# Altium schematic sheet OverviewRev2.SchDoc
size 594 x 420 mm; SheetNumber: 10; SheetTotal: 14
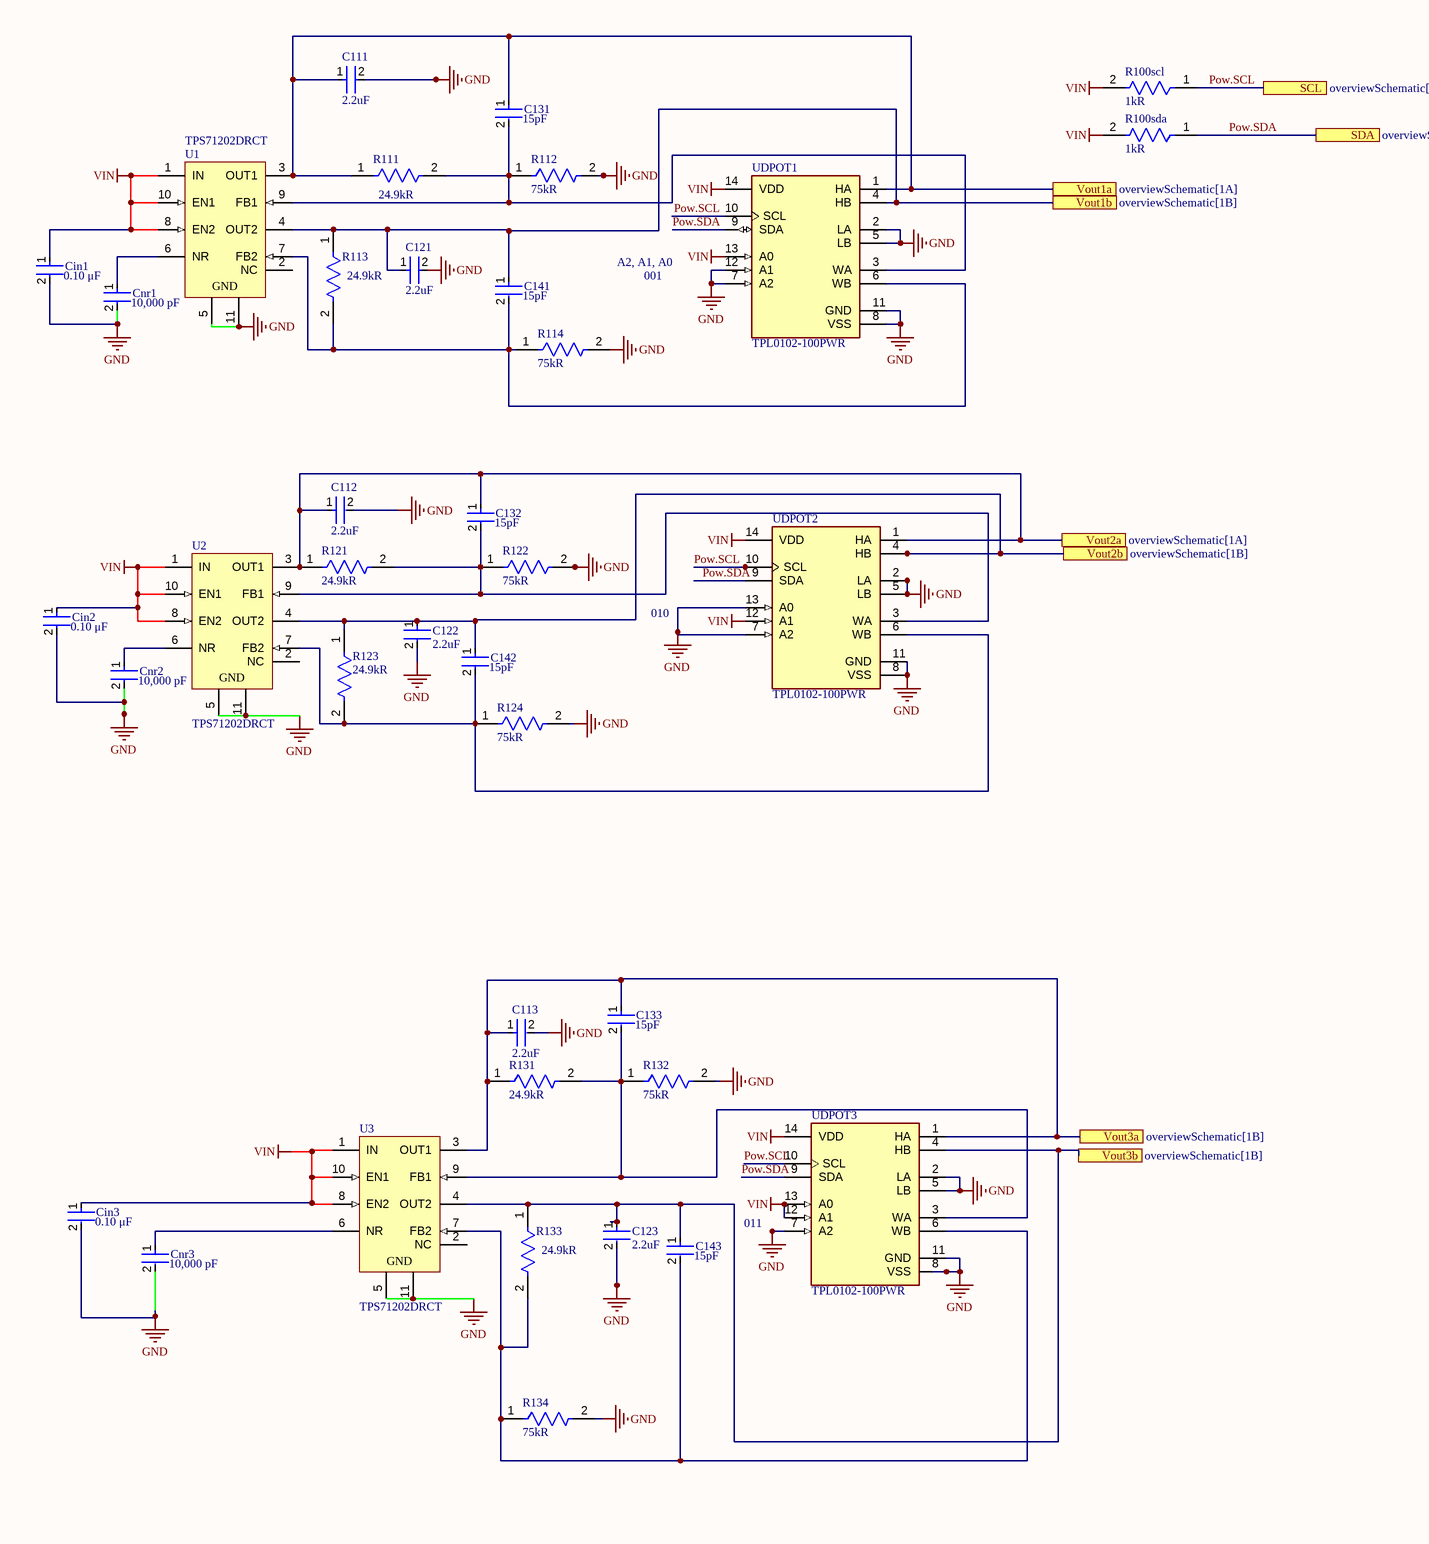
[diagram p0: OverviewRev2.SchDoc, left]
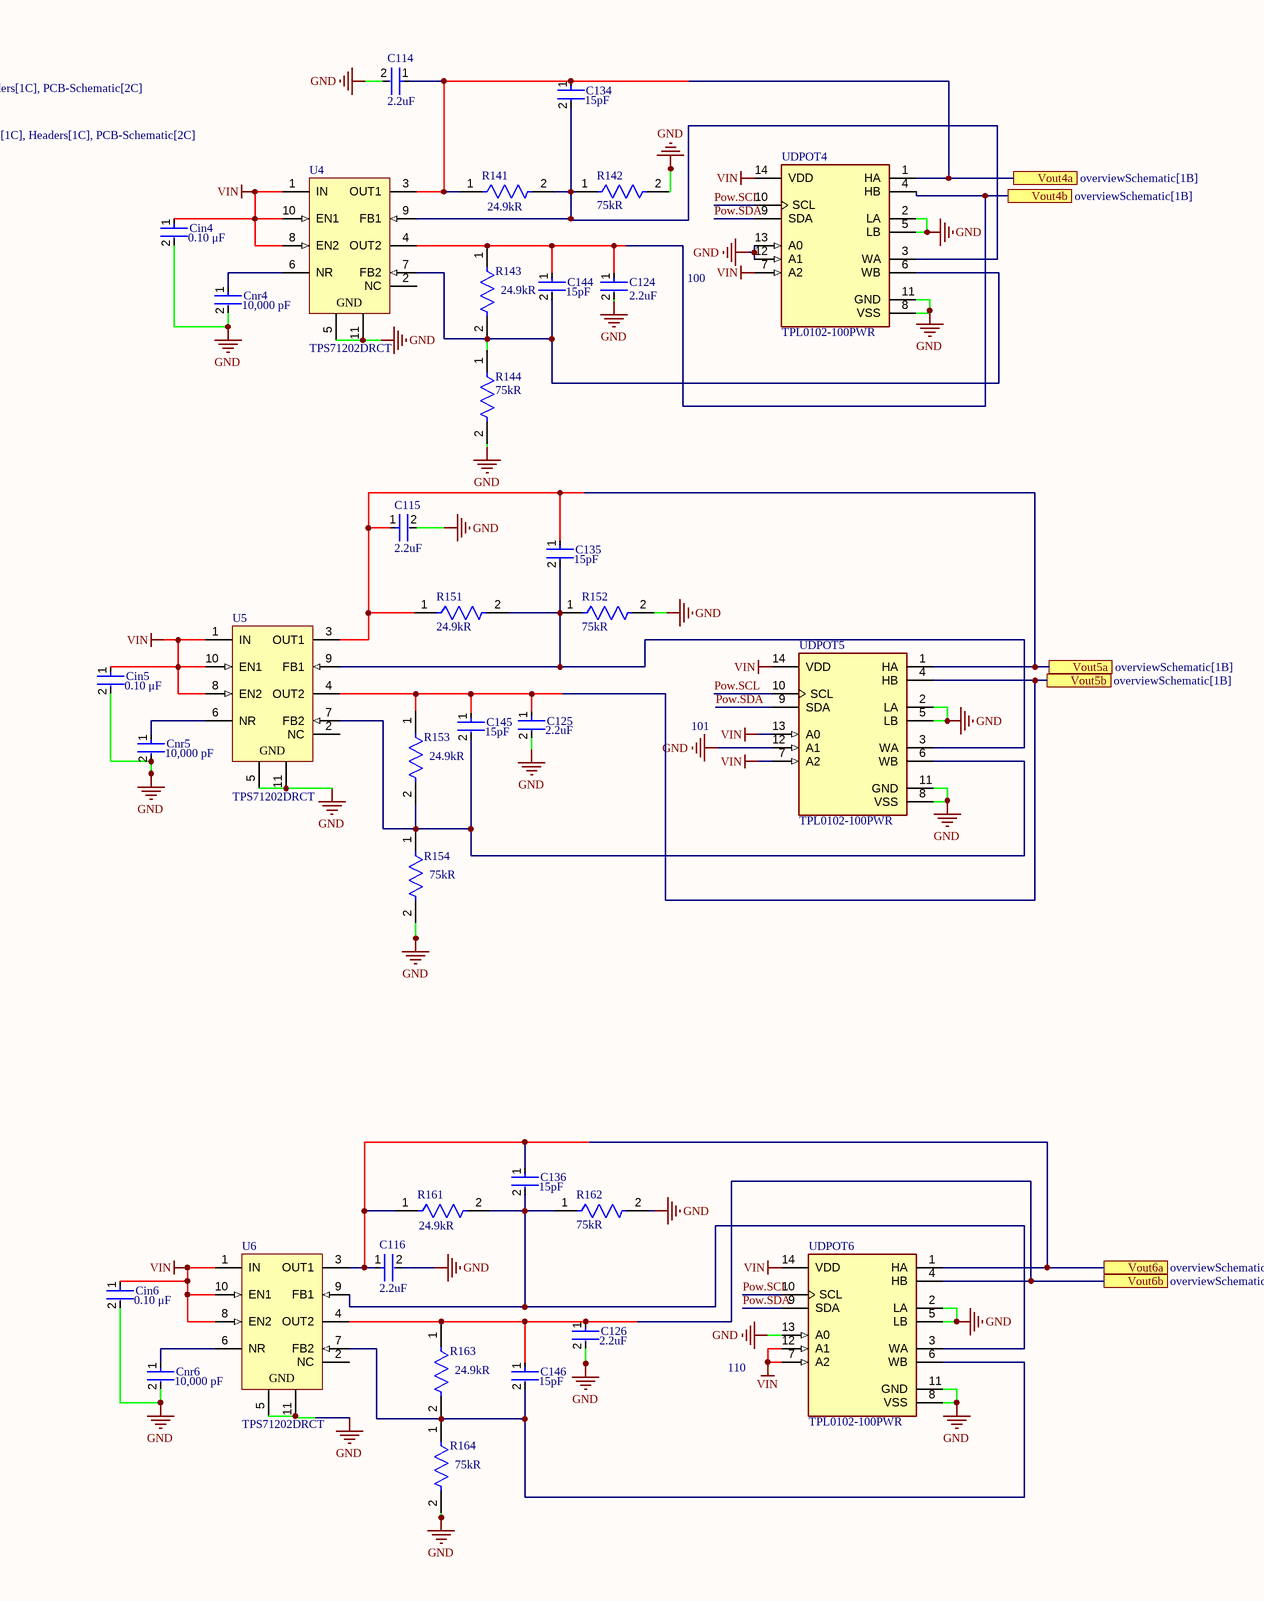
[diagram p1: OverviewRev2.SchDoc, right]

## Parts
C111  Capacitance: 2.2uF  [FP-GRM188-0_1-e0_2_0_5-MFG]  (hidden comment: GRM188R71A225KE15D)
C112  Capacitance: 2.2uF  [FP-GRM188-0_1-e0_2_0_5-MFG]  (hidden comment: GRM188R71A225KE15D)
C113  Capacitance: 2.2uF  [FP-GRM188-0_1-e0_2_0_5-MFG]  (hidden comment: GRM188R71A225KE15D)
C114  Capacitance: 2.2uF  [FP-GRM188-0_1-e0_2_0_5-MFG]  (hidden comment: GRM188R71A225KE15D)
C115  Capacitance: 2.2uF  [FP-GRM188-0_1-e0_2_0_5-MFG]  (hidden comment: GRM188R71A225KE15D)
C116  Capacitance: 2.2uF  [FP-GRM188-0_1-e0_2_0_5-MFG]  (hidden comment: GRM188R71A225KE15D)
C121  Capacitance: 2.2uF  [FP-GRM188-0_1-e0_2_0_5-MFG]  (hidden comment: GRM188R71A225KE15D)
C122  Capacitance: 2.2uF  [FP-GRM188-0_1-e0_2_0_5-MFG]  (hidden comment: GRM188R71A225KE15D)
C123  Capacitance: 2.2uF  [FP-GRM188-0_1-e0_2_0_5-MFG]  (hidden comment: GRM188R71A225KE15D)
C124  Capacitance: 2.2uF  [FP-GRM188-0_1-e0_2_0_5-MFG]  (hidden comment: GRM188R71A225KE15D)
C125  Capacitance: 2.2uF  [FP-GRM188-0_1-e0_2_0_5-MFG]  (hidden comment: GRM188R71A225KE15D)
C126  Capacitance: 2.2uF  [FP-GRM188-0_1-e0_2_0_5-MFG]  (hidden comment: GRM188R71A225KE15D)
C131  Capacitance: 15pF  [FP-CC0402-0_55-IPC_B]  (hidden comment: CC0402JRNPO9BN150)
C132  Capacitance: 15pF  [FP-CC0402-0_55-IPC_B]  (hidden comment: CC0402JRNPO9BN150)
C133  Capacitance: 15pF  [FP-CC0402-0_55-IPC_B]  (hidden comment: CC0402JRNPO9BN150)
C134  Capacitance: 15pF  [FP-CC0402-0_55-IPC_B]  (hidden comment: CC0402JRNPO9BN150)
C135  Capacitance: 15pF  [FP-CC0402-0_55-IPC_B]  (hidden comment: CC0402JRNPO9BN150)
C136  Capacitance: 15pF  [FP-CC0402-0_55-IPC_B]  (hidden comment: CC0402JRNPO9BN150)
C141  Capacitance: 15pF  [FP-CC0402-0_55-IPC_B]  (hidden comment: CC0402JRNPO9BN150)
C142  Capacitance: 15pF  [FP-CC0402-0_55-IPC_B]  (hidden comment: CC0402JRNPO9BN150)
C143  Capacitance: 15pF  [FP-CC0402-0_55-IPC_B]  (hidden comment: CC0402JRNPO9BN150)
C144  Capacitance: 15pF  [FP-CC0402-0_55-IPC_B]  (hidden comment: CC0402JRNPO9BN150)
C145  Capacitance: 15pF  [FP-CC0402-0_55-IPC_B]  (hidden comment: CC0402JRNPO9BN150)
C146  Capacitance: 15pF  [FP-CC0402-0_55-IPC_B]  (hidden comment: CC0402JRNPO9BN150)
Cin1  Capacitance: 0.10 μF  [FP-C0603C-CF-MFG]  (hidden comment: C0603C104M4RACTU)
Cin2  Capacitance: 0.10 μF  [FP-C0603C-CF-MFG]  (hidden comment: C0603C104M4RACTU)
Cin3  Capacitance: 0.10 μF  [FP-C0603C-CF-MFG]  (hidden comment: C0603C104M4RACTU)
Cin4  Capacitance: 0.10 μF  [FP-C0603C-CF-MFG]  (hidden comment: C0603C104M4RACTU)
Cin5  Capacitance: 0.10 μF  [FP-C0603C-CF-MFG]  (hidden comment: C0603C104M4RACTU)
Cin6  Capacitance: 0.10 μF  [FP-C0603C-CF-MFG]  (hidden comment: C0603C104M4RACTU)
Cnr1  value 10,000 pF  [FP-C0603C-CF-MFG]  (hidden comment: C0603C103M5RACTU)
Cnr2  value 10,000 pF  [FP-C0603C-CF-MFG]  (hidden comment: C0603C103M5RACTU)
Cnr3  value 10,000 pF  [FP-C0603C-CF-MFG]  (hidden comment: C0603C103M5RACTU)
Cnr4  value 10,000 pF  [FP-C0603C-CF-MFG]  (hidden comment: C0603C103M5RACTU)
Cnr5  value 10,000 pF  [FP-C0603C-CF-MFG]  (hidden comment: C0603C103M5RACTU)
Cnr6  value 10,000 pF  [FP-C0603C-CF-MFG]  (hidden comment: C0603C103M5RACTU)
R100scl  Resistance: 1kR  [FP-RC1608-IPC_A]  (hidden comment: RC1608J102CS)
R100sda  Resistance: 1kR  [FP-RC1608-IPC_A]  (hidden comment: RC1608J102CS)
R111  Resistance: 24.9kR  [FP-CRCW0603-e3-IPC_B]  (hidden comment: CRCW060324K9FKEA)
R112  Resistance: 75kR  [FP-RC1608-IPC_A]  (hidden comment: RC1608J753CS)
R113  Resistance: 24.9kR  [FP-CRCW0603-e3-IPC_B]  (hidden comment: CRCW060324K9FKEA)
R114  Resistance: 75kR  [FP-RC1608-IPC_A]  (hidden comment: RC1608J753CS)
R121  Resistance: 24.9kR  [FP-CRCW0603-e3-IPC_B]  (hidden comment: CRCW060324K9FKEA)
R122  Resistance: 75kR  [FP-RC1608-IPC_A]  (hidden comment: RC1608J753CS)
R123  Resistance: 24.9kR  [FP-CRCW0603-e3-IPC_B]  (hidden comment: CRCW060324K9FKEA)
R124  Resistance: 75kR  [FP-RC1608-IPC_A]  (hidden comment: RC1608J753CS)
R131  Resistance: 24.9kR  [FP-CRCW0603-e3-IPC_B]  (hidden comment: CRCW060324K9FKEA)
R132  Resistance: 75kR  [FP-RC1608-IPC_A]  (hidden comment: RC1608J753CS)
R133  Resistance: 24.9kR  [FP-CRCW0603-e3-IPC_B]  (hidden comment: CRCW060324K9FKEA)
R134  Resistance: 75kR  [FP-RC1608-IPC_A]  (hidden comment: RC1608J753CS)
R141  Resistance: 24.9kR  [FP-CRCW0603-e3-IPC_B]  (hidden comment: CRCW060324K9FKEA)
R142  Resistance: 75kR  [FP-RC1608-IPC_A]  (hidden comment: RC1608J753CS)
R143  Resistance: 24.9kR  [FP-CRCW0603-e3-IPC_B]  (hidden comment: CRCW060324K9FKEA)
R144  Resistance: 75kR  [FP-RC1608-IPC_A]  (hidden comment: RC1608J753CS)
R151  Resistance: 24.9kR  [FP-CRCW0603-e3-IPC_B]  (hidden comment: CRCW060324K9FKEA)
R152  Resistance: 75kR  [FP-RC1608-IPC_A]  (hidden comment: RC1608J753CS)
R153  Resistance: 24.9kR  [FP-CRCW0603-e3-IPC_B]  (hidden comment: CRCW060324K9FKEA)
R154  Resistance: 75kR  [FP-RC1608-IPC_A]  (hidden comment: RC1608J753CS)
R161  Resistance: 24.9kR  [FP-CRCW0603-e3-IPC_B]  (hidden comment: CRCW060324K9FKEA)
R162  Resistance: 75kR  [FP-RC1608-IPC_A]  (hidden comment: RC1608J753CS)
R163  Resistance: 24.9kR  [FP-CRCW0603-e3-IPC_B]  (hidden comment: CRCW060324K9FKEA)
R164  Resistance: 75kR  [FP-RC1608-IPC_A]  (hidden comment: RC1608J753CS)
U1  TPS71202DRCT  [DRC0010L_V]
U2  TPS71202DRCT  [DRC0010L_V]
U3  TPS71202DRCT  [DRC0010L_V]
U4  TPS71202DRCT  [DRC0010L_V]
U5  TPS71202DRCT  [DRC0010L_V]
U6  TPS71202DRCT  [DRC0010L_V]
UDPOT1  TPL0102-100PWR  [FP-PW0014A-IPC_C]
UDPOT2  TPL0102-100PWR  [FP-PW0014A-IPC_C]
UDPOT3  TPL0102-100PWR  [FP-PW0014A-IPC_C]
UDPOT4  TPL0102-100PWR  [FP-PW0014A-IPC_C]
UDPOT5  TPL0102-100PWR  [FP-PW0014A-IPC_C]
UDPOT6  TPL0102-100PWR  [FP-PW0014A-IPC_C]

## Ports
SCL (see overviewSchematic[1C], Headers[1C], PCB-Schematic[2C]), SDA (see overviewSchematic[1C], Headers[1C], PCB-Schematic[2C]), Vout1a (see overviewSchematic[1A]), Vout1b (see overviewSchematic[1B]), Vout2a (see overviewSchematic[1A]), Vout2b (see overviewSchematic[1B]), Vout3a (see overviewSchematic[1B]), Vout3b (see overviewSchematic[1B]), Vout4a (see overviewSchematic[1B]), Vout4b (see overviewSchematic[1B]), Vout5a (see overviewSchematic[1B]), Vout5b (see overviewSchematic[1B]), Vout6a (see overviewSchematic[1B]), Vout6b (see overviewSchematic[1B])

## Nets
GND: C111.2 C112.2 C113.2 C114.2 C115.2 C116.2 C121.2 C122.2 C123.2 C124.2 C125.2 C126.2 Cin1.2 Cin2.2 Cin3.2 Cin4.2 Cin5.2 Cin6.2 Cnr1.2 Cnr2.2 Cnr3.2 Cnr4.2 Cnr5.2 Cnr6.2 R112.2 R114.2 R122.2 R124.2 R132.2 R134.2 R142.2 R144.2 R152.2 R154.2 R162.2 R164.2 U1.5(GND) U1.11(GND) U2.5(GND) U2.11(GND) U3.5(GND) U3.11(GND) U4.5(GND) U4.11(GND) U5.5(GND) U5.11(GND) U6.5(GND) U6.11(GND) UDPOT1.2(LA) UDPOT1.5(LB) UDPOT1.7(A2) UDPOT1.8(VSS) UDPOT1.11(GND) UDPOT1.12(A1) UDPOT2.2(LA) UDPOT2.5(LB) UDPOT2.7(A2) UDPOT2.8(VSS) UDPOT2.11(GND) UDPOT2.13(A0) UDPOT3.2(LA) UDPOT3.5(LB) UDPOT3.7(A2) UDPOT3.8(VSS) UDPOT3.11(GND) UDPOT4.2(LA) UDPOT4.5(LB) UDPOT4.8(VSS) UDPOT4.11(GND) UDPOT4.12(A1) UDPOT4.13(A0) UDPOT5.2(LA) UDPOT5.5(LB) UDPOT5.8(VSS) UDPOT5.11(GND) UDPOT5.12(A1) UDPOT6.2(LA) UDPOT6.5(LB) UDPOT6.8(VSS) UDPOT6.11(GND) UDPOT6.13(A0)
VIN: Cin1.1 Cin2.1 Cin3.1 Cin4.1 Cin5.1 Cin6.1 R100scl.2 R100sda.2 U1.1(IN) U1.8(EN2) U1.10(EN1) U2.1(IN) U2.8(EN2) U2.10(EN1) U3.1(IN) U3.8(EN2) U3.10(EN1) U4.1(IN) U4.8(EN2) U4.10(EN1) U5.1(IN) U5.8(EN2) U5.10(EN1) U6.1(IN) U6.8(EN2) U6.10(EN1) UDPOT1.13(A0) UDPOT1.14(VDD) UDPOT2.12(A1) UDPOT2.14(VDD) UDPOT3.12(A1) UDPOT3.13(A0) UDPOT3.14(VDD) UDPOT4.7(A2) UDPOT4.14(VDD) UDPOT5.7(A2) UDPOT5.13(A0) UDPOT5.14(VDD) UDPOT6.7(A2) UDPOT6.12(A1) UDPOT6.14(VDD)
Pow.SCL: R100scl.1 UDPOT1.10(SCL) UDPOT2.10(SCL) UDPOT3.10(SCL) UDPOT4.10(SCL) UDPOT5.10(SCL) UDPOT6.10(SCL) ; port SCL
Pow.SDA: R100sda.1 UDPOT1.9(SDA) UDPOT2.9(SDA) UDPOT3.9(SDA) UDPOT4.9(SDA) UDPOT5.9(SDA) UDPOT6.9(SDA) ; port SDA
Vout1a: C111.1 C131.1 R111.1 U1.3(OUT1) UDPOT1.1(HA) ; port Vout1a
Vout1b: C121.1 C141.1 R113.1 U1.4(OUT2) UDPOT1.4(HB) ; port Vout1b
Vout2a: C112.1 C132.1 R121.1 U2.3(OUT1) UDPOT2.1(HA) ; port Vout2a
Vout2b: C122.1 C142.1 R123.1 U2.4(OUT2) UDPOT2.4(HB) ; port Vout2b
Vout3a: C113.1 C133.1 R131.1 U3.3(OUT1) UDPOT3.1(HA) ; port Vout3a
Vout3b: C123.1 C143.1 R133.1 U3.4(OUT2) UDPOT3.4(HB) ; port Vout3b
Vout4a: C114.1 C134.1 R141.1 U4.3(OUT1) UDPOT4.1(HA) ; port Vout4a
Vout4b: C124.1 C144.1 R143.1 U4.4(OUT2) UDPOT4.4(HB) ; port Vout4b
Vout5a: C115.1 C135.1 R151.1 U5.3(OUT1) UDPOT5.1(HA) ; port Vout5a
Vout5b: C125.1 C145.1 R153.1 U5.4(OUT2) UDPOT5.4(HB) ; port Vout5b
Vout6a: C116.1 C136.1 R161.1 U6.3(OUT1) UDPOT6.1(HA) ; port Vout6a
Vout6b: C126.1 C146.1 R163.1 U6.4(OUT2) UDPOT6.4(HB) ; port Vout6b
NetC131_2: C131.2 R111.2 R112.1 U1.9(FB1) UDPOT1.3(WA)
NetC132_2: C132.2 R121.2 R122.1 U2.9(FB1) UDPOT2.3(WA)
NetC133_2: C133.2 R131.2 R132.1 U3.9(FB1) UDPOT3.3(WA)
NetC134_2: C134.2 R141.2 R142.1 U4.9(FB1) UDPOT4.3(WA)
NetC135_2: C135.2 R151.2 R152.1 U5.9(FB1) UDPOT5.3(WA)
NetC136_2: C136.2 R161.2 R162.1 U6.9(FB1) UDPOT6.3(WA)
NetC141_2: C141.2 R113.2 R114.1 U1.7(FB2) UDPOT1.6(WB)
NetC142_2: C142.2 R123.2 R124.1 U2.7(FB2) UDPOT2.6(WB)
NetC143_2: C143.2 R133.2 R134.1 U3.7(FB2) UDPOT3.6(WB)
NetC144_2: C144.2 R143.2 R144.1 U4.7(FB2) UDPOT4.6(WB)
NetC145_2: C145.2 R153.2 R154.1 U5.7(FB2) UDPOT5.6(WB)
NetC146_2: C146.2 R163.2 R164.1 U6.7(FB2) UDPOT6.6(WB)
NetCnr1_1: Cnr1.1 U1.6(NR)
NetCnr2_1: Cnr2.1 U2.6(NR)
NetCnr3_1: Cnr3.1 U3.6(NR)
NetCnr4_1: Cnr4.1 U4.6(NR)
NetCnr5_1: Cnr5.1 U5.6(NR)
NetCnr6_1: Cnr6.1 U6.6(NR)

Not connected (* = marked no-connect by the designer): U1 2(NC); U2 2(NC); U3 2(NC); U4 2(NC); U5 2(NC); U6 2(NC)

## Notes on the sheet
- A2, A1, A0
- 001
- 100
- 010
- 101
- 011
- 110
- DWG NO:
- REV:
- THIS DOCUMENT AND THE DATA DISCLOSED HEREIN OR
- HEREWITH IS THE PROPERTY OF ALTIUM LIMITED AND MAY
- BE FREELY DISTRIBUTED IN WHOLE. NO RIGHTS ARE
- RESERVED OR EXPRESS OR IMPLIED WARANTEE GIVEN.
- REVISION
- DESCRIPTION
- DATE
- APPROVED
- ENG:
- APPROVALS
- PROJECT
- DSN:
- CHK:
- REFERENCE DOCUMENTS
- PROJECT REVISION:
- TITLE
- DOCUMENT REVISION:
- DESIGN ITEM:
- BOM:
- FAB DWG:
- PCB DWG:
- ASSY DWG:
- SCALE:
- A2
- SIZE
- CAGE CODE
- FILE NAME
- DWG NO.
- SHEET
- OF
- REV

## Library data of the parts
C111-C116 C121-C126 = CMP-2006-02836-2: Chip Multilayer Ceramic Capacitors for General Purpose, 0603, 2.2uF, X7R, 15%, 10%, 10V; Case Code (Metric): 1608; Height: 0.8mm; Packaging: Cut Tape; Voltage: 10V; Lead Free: Lead Free; Min Operating Temperature: -55°C; Voltage Rating (DC): 10V; Max Operating Temperature: 125°C; Voltage Rating: 10V; Dielectric: X7R; Depth: 0.8mm; Case Code (Imperial): 0603; Termination: SMD/SMT; Case/Package: 0603; Number of Pins: 2; REACH SVHC: No SVHC; Mount: Surface Mount; Width: 0.031inch; Material: Ceramic; Package Quantity: 1; Weight: 7.1E-05oz; Length: 1.6mm; Thickness: 0.035inch; Tolerance: 10%
C131-C136 C141-C146 = CMP-03422-001519-1: CAP CER 15PF 50V C0G/NPO 0402; Insulation Resistance: 100GR; Dielectric Material: Ceramic; Tolerance: 5%; Dielectric: C0G; Width: 0.02inch; Case Code (Imperial): 0402; Voltage Rating (DC): 50V; Case Code (Metric): 1005; REACH SVHC: No SVHC; Mount: Surface Mount; Min Operating Temperature: -55°C; Depth: 0.5mm; Voltage Rating: 50V; Voltage: 50V; Thickness: 0.022inch; Length: 1mm; Max Operating Temperature: 125°C; Lead Free: Lead Free; Height: 0.5mm; Packaging: Tape and Reel; Radiation Hardening: No; Package Quantity: 1; Case/Package: 0402; Number of Pins: 2; RoHS Compliant: Yes; Resistor Type: Ceramic; Series: CC; Termination: SMD/SMT
Cin1-Cin6 = CMP-2006-03067-2: CAP CER 0.1UF 16V X7R 0603; Manufacturer: KEMET; Temperature Coefficient: 30ppm/°C; Value: 0.10 μF; Tolerance: 0.2; Automotive Grade: Grade 1; Temperature Range Low: -55°C; Manufacturer Part Number: C0603C104M4RACTU; ComponentLink2Description: Datasheet; Mouser Description: Multilayer Ceramic Capacitors MLCC - SMD/SMT 16volts 0.1uF X7R 20%; ComponentLink2URL: https://api.kemet.com/component-edge/download/datasheet/C0603C100J5GACAUTO.pdf; Device Class L2: Capacitors; Automotive: Yes; Temperature Range High: +125°C; Voltage Rating: 16 V; Lead Free: Yes; Temperature Characteristic: X7R; Package: C0603C-CF; RoHS: TRUE; Device Class L1: Passive Components; Temperature: -55°C to +125°C; Digikey Description: CAP CER 0.1UF 16V X7R 0603; Category: Cap; Device Class L3: Ceramic Capacitors; Material: Ceramic; Octopart: https://octopart.com/c0603c104m4ractu-kemet-134275; Height: 0.87mm
Cnr1-Cnr6 = CMP-2006-03052-2: CAP CER 10000PF 50V 20% X7R 0603; Manufacturer: KEMET; Temperature Coefficient: 30ppm/°C; Automotive Grade: Grade 1; Tolerance: 0.2; Manufacturer Part Number: C0603C103M5RACTU; Device Class L2: Capacitors; Device Class L3: Ceramic Capacitors; RoHS: TRUE; Mouser Description: Multilayer Ceramic Capacitors MLCC - SMD/SMT 50volts 10000pF X7R 20%; Category: Cap; Temperature: -55°C to +125°C; ComponentLink2Description: Datasheet; Package: C0603C-CF; Octopart: https://octopart.com/c0603c103m5ractu-kemet-96399; ComponentLink2URL: https://api.kemet.com/component-edge/download/datasheet/C0603C100J5GACAUTO.pdf; Temperature Range High: +125°C; Material: Ceramic; Digikey Description: CAP CER 10000PF 50V 20% X7R 0603; Automotive: Yes; Height: 0.87mm; Voltage Rating: 50 V; Device Class L1: Passive Components; Capacitance: 10,000 pF; Temperature Range Low: -55°C; Lead Free: Yes; Temperature Characteristic: X7R
R100scl R100sda = CMP-13261-002301-1: Res Thick Film 0603 1kΩ 5% 0.1W ±100ppm/°C Molded SMD T/R; Power Rating: 100mW; Voltage Rating (DC): 50V; Contact Plating: Tin; Mount: Surface Mount; Number of Terminations: 2; Features: Moisture Resistant; Max Power Dissipation: 100mW; Military Standard: Not; Case/Package: 0603; Radiation Hardening: No; Temperature Coefficient: 100ppm/°C; Length: 1.6mm; Height: 0.022inch; Case Code (Metric): 1608; Max Operating Temperature: 155°C; Composition: Thick Film; Tolerance: 5%; Width: 0.031inch; Depth: 0.8mm; Packaging: Tape and Reel; Lead Free: Lead Free; Case Code (Imperial): 0603; Min Operating Temperature: -55°C
R111 R113 R121 R123 R131 R133 R141 R143 R151 R153 R161 R163 = CMP-2000-03121-2: RES Thick Film, 24.9kΩ, 1%, 0.1W, 100ppm/°C, 0603; Voltage Rating: 75V; Power Rating: 100mW; Case Code (Imperial): 0603; Depth: 0.85mm; Package Quantity: 10; Packaging: Tape and Reel; Weight: 7.1E-05oz; Case Code (Metric): 1608; Military Standard: Not; Height: 0.45mm; Features: Automotive AEC-Q200; Radiation Hardening: No; Max Operating Temperature: 155°C; Max Power Dissipation: 100mW; Mount: Surface Mount; Width: 0.85mm; Composition: Thick Film; Length: 1.55mm; Temperature Coefficient: 100ppm/°C; Case/Package: 0603; Lead Free: Lead Free; Contact Plating: Tin; Voltage Rating (DC): 75V; Tolerance: 1%; Number of Terminations: 2; Min Operating Temperature: -55°C; Termination: SMD/SMT
R112 R114 R122 R124 R132 R134 R142 R144 R152 R154 R162 R164 = CMP-13261-003986-1: Res Thick Film 0603 75kΩ 5% 0.1W ±100ppm/°C Molded SMD T/R; Voltage Rating (DC): 50V; Max Power Dissipation: 100mW; Case Code (Metric): 1608; Military Standard: Not; Packaging: Tape and Reel; Number of Terminations: 2; Case Code (Imperial): 0603; Case/Package: 0603; Features: Moisture Resistant; Width: 0.031inch; Min Operating Temperature: -55°C; Tolerance: 5%; Depth: 0.8mm; Max Operating Temperature: 155°C; Length: 0.063inch; Package Quantity: 1; Composition: Thick Film; Height: 0.022inch; Temperature Coefficient: 100ppm/°C; Contact Plating: Tin; Lead Free: Lead Free; Radiation Hardening: No; Power Rating: 100mW
U1-U6 = CMP-0389-00051-2: Dual Output High PSRR LDO, 200 mA, 2.7 to 5.5 V Input, 10-pin SON (DRC), -40 to 125 degC, Green (RoHS & no Sb/Br); Manufacturer: Texas Instruments; Iout2(A): 0.2; Vout(Max)(V): 5.5; Vout2(Min)(V): 1.2; Iq(Typ)(mA): 0.3; Vin(Min)(V): 2.7; Vdo(Typ)(mV): 125; SubFamily: Dual Channel LDO; DatasheetVersion: SBVS049D; Iout(Max)(A): 0.2; ComponentLink1URL: http://www.ti.com/; ComponentLink2Description: Datasheet; Eco-Plan: Green (RoHS & no Sb/Br); Vout2(Max)(V): 5.5; Mounting Technology: Surface Mount; PackageVersion: 4204102-3/L; ComponentLink1Description: Manufacturer URL; PackageDescription: 10-Pin Plastic Small Outline, Body 3 x 3 mm, Pitch 0.5 mm; Vout(Min)(V): 1.2; ComponentLink3Description: Package Specification; PartNumber: TPS71202DRCT; PackageReference: DRC0010L; Vin(Max)(V): 5.5; ComponentLink3URL: http://www.ti.com/litv/pdf/mpds117k; ComponentLink2URL: http://www.ti.com/general/docs/lit/getliterature.tsp?genericPartNumber=TPS71202&fileType=pdf
UDPOT1-UDPOT6 = CMP-0004-01107-2: IC DGT POT 100KOHM 256TP 14TSSOP; Temperature Coefficient: 4ppm/°C; Differential Nonlinearity: 0.25LSB; Number of Positions: 256; Min Supply Voltage: -2.7V; Max Supply Voltage: 5.5V; Number of Channels: 2; Resistance: 100kR; Memory Type: Non-Volatile; Nominal Supply Current: 2mA; Tolerance: 20%; Integral Nonlinearity (INL): 0.5LSB; Bandwidth: 250kHz; Interface: I2C; Dual Supply Voltage: 2.75V; Package Quantity: 2000; Case/Package: TSSOP; Min Operating Temperature: -40°C; Number of DAC Channels: 2; Max Operating Temperature: 85°C; Number of Taps: 256; Taper: Linear; Number of Pins: 14; Packaging: Tape and Reel; Radiation Hardening: No; Height: 1.05mm; Lead Free: Lead Free; Width: 4.5mm; Number of Circuits: 2; Length: 5.1mm; REACH SVHC: No SVHC; Composition: Potentiometer